# EAGLE schematic 4 (EAGLE 9.2.0)
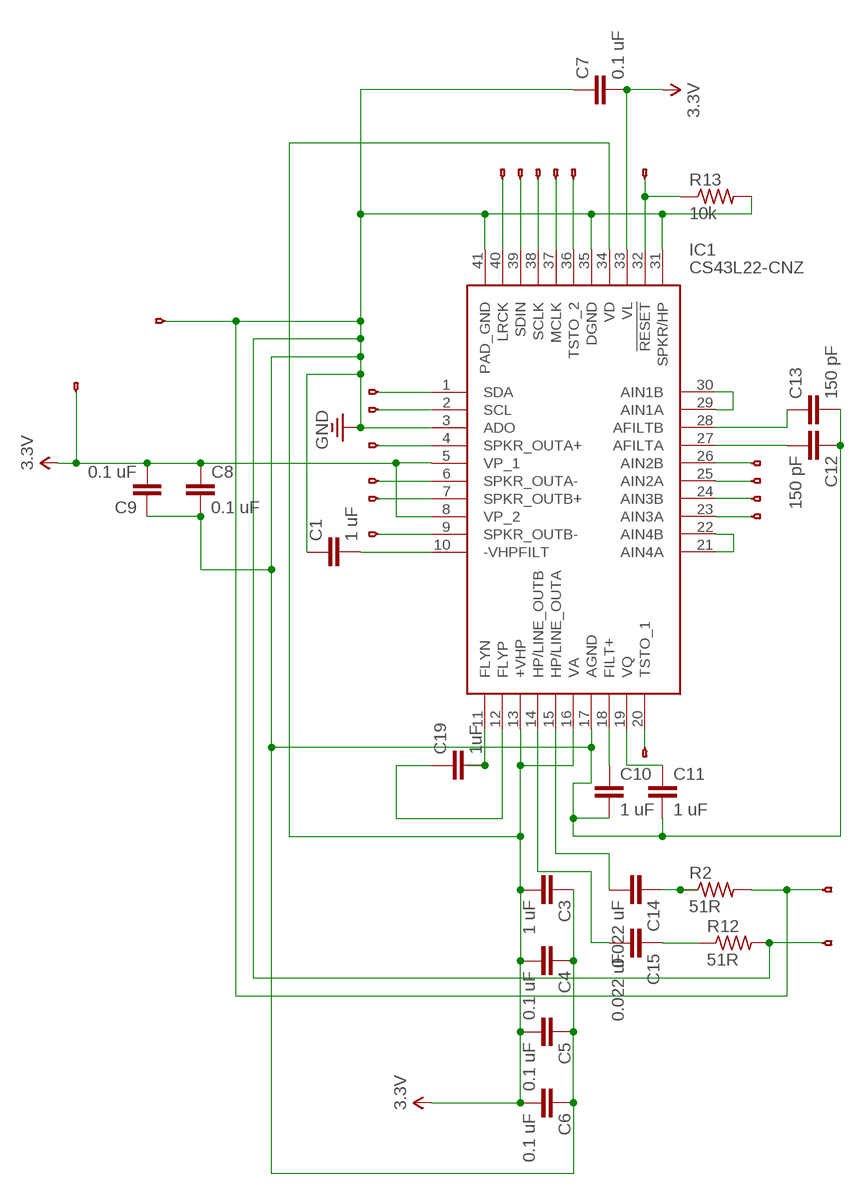
[diagram p0: schematic, sheet 1]

## Parts
C1  1 uF  CAPKIT  [CAP-PTH-SMALL-KIT]
C3  1 uF  CAPKIT  [CAP-PTH-SMALL-KIT]
C4  0.1 uF  CAPKIT  [CAP-PTH-SMALL-KIT]
C5  0.1 uF  CAPKIT  [CAP-PTH-SMALL-KIT]
C6  0.1 uF  CAPKIT  [CAP-PTH-SMALL-KIT]
C7  0.1 uF  CAPKIT  [CAP-PTH-SMALL-KIT]
C8  0.1 uF  CAPKIT  [CAP-PTH-SMALL-KIT]
C9  0.1 uF  CAPKIT  [CAP-PTH-SMALL-KIT]
C10  1 uF  CAPKIT  [CAP-PTH-SMALL-KIT]
C11  1 uF  CAPKIT  [CAP-PTH-SMALL-KIT]
C12  150 pF  CAPKIT  [CAP-PTH-SMALL-KIT]
C13  150 pF  CAPKIT  [CAP-PTH-SMALL-KIT]
C14  0.022 uF  CAPKIT  [CAP-PTH-SMALL-KIT]
C15  0.022 uF  CAPKIT  [CAP-PTH-SMALL-KIT]
C19  1uF  C2,5-3  [C2.5-3]
IC1  CS43L22-CNZ  [QFN50P600X600X100-41N]
JP1  HEADERHOLE-HEADERHOLE  [1X1-HEADER-HOLE]
JP2  HEADERHOLE-HEADERHOLE  [1X1-HEADER-HOLE]
JP3  HEADERHOLE-HEADERHOLE  [1X1-HEADER-HOLE]
JP4  HEADERHOLE-HEADERHOLE  [1X1-HEADER-HOLE]
JP5  HEADERHOLE-HEADERHOLE  [1X1-HEADER-HOLE]
JP6  HEADERHOLE-HEADERHOLE  [1X1-HEADER-HOLE]
JP7  HEADERHOLE-HEADERHOLE  [1X1-HEADER-HOLE]
JP8  HEADERHOLE-HEADERHOLE  [1X1-HEADER-HOLE]
JP9  HEADERHOLE-HEADERHOLE  [1X1-HEADER-HOLE]
JP10  HEADERHOLE-HEADERHOLE  [1X1-HEADER-HOLE]
JP11  HEADERHOLE-HEADERHOLE  [1X1-HEADER-HOLE]
JP12  HEADERHOLE-HEADERHOLE  [1X1-HEADER-HOLE]
JP13  HEADERHOLE-HEADERHOLE  [1X1-HEADER-HOLE]
JP14  HEADERHOLE-HEADERHOLE  [1X1-HEADER-HOLE]
JP15  HEADERHOLE-HEADERHOLE  [1X1-HEADER-HOLE]
JP16  HEADERHOLE-HEADERHOLE  [1X1-HEADER-HOLE]
JP17  HEADERHOLE-HEADERHOLE  [1X1-HEADER-HOLE]
JP18  HEADERHOLE-HEADERHOLE  [1X1-HEADER-HOLE]
JP19  HEADERHOLE-HEADERHOLE  [1X1-HEADER-HOLE]
JP23  HEADERHOLE-HEADERHOLE  [1X1-HEADER-HOLE]
JP24  HEADERHOLE-HEADERHOLE  [1X1-HEADER-HOLE]
R2  51R  R-US_0204/2V  [0204V]
R12  51R  R-US_0204/2V  [0204V]
R13  10k  R-US_0204/2V  [0204V]

## Nets
3.3V: C3.2 C4.2 C5.2 C6.2 C7.2 C8.1 C9.2 IC1.5(VP_1) IC1.8(VP_2) IC1.13(+VHP) IC1.16(VA) IC1.33(VL) IC1.34(VD) JP24.1
GND: C1.1 C3.1 C4.1 C5.1 C6.1 C7.1 C8.2 C9.1 C10.2 C11.2 C12.1 C13.2 IC1.3(ADO) IC1.17(AGND) IC1.31(SPKR/HP) IC1.35(DGND) IC1.41(PAD_GND) JP8.1 JP9.1 JP23.1 R2.2 R12.2 R13.2
N$1: C19.2 IC1.11(FLYN)
N$2: IC1.1(SDA) JP1.1
N$3: IC1.2(SCL) JP2.1
N$4: IC1.37(MCLK) JP3.1
N$5: IC1.38(SCLK) JP4.1
N$6: IC1.39(SDIN) JP5.1
N$7: IC1.40(LRCK) JP6.1
N$8: IC1.32(!RESET) JP7.1 R13.1
N$9: C1.2 IC1.10(-VHPFILT)
N$10: C19.1 IC1.12(FLYP)
N$11: C11.1 IC1.19(VQ)
N$13: C12.2 IC1.27(AFILTA)
N$14: C13.1 IC1.28(AFILTB)
N$15: C14.2 IC1.15(HP/LINE_OUTA)
N$16: C10.1 IC1.18(FILT+)
N$17: C15.2 IC1.14(HP/LINE_OUTB)
N$18: C14.1 R2.1
N$19: C15.1 R12.1
N$21: IC1.4(SPKR_OUTA+) JP10.1
N$22: IC1.6(SPKR_OUTA-) JP11.1
N$23: IC1.7(SPKR_OUTB+) JP12.1
N$24: IC1.9(SPKR_OUTB-) JP13.1
N$25: IC1.26(AIN2B) JP17.1
N$26: IC1.25(AIN2A) JP16.1
N$27: IC1.24(AIN3B) JP15.1
N$28: IC1.23(AIN3A) JP14.1
N$29: IC1.36(TSTO_2) JP19.1
N$30: IC1.20(TSTO_1) JP18.1
N$31: IC1.29(AIN1A) IC1.30(AIN1B)
N$32: IC1.21(AIN4A) IC1.22(AIN4B)

## Library data of the parts
C1 C3-C15 = F405Pill:CAP: Capacitor Standard 0603 ceramic capacitor, and 0.1" leaded capacitor.
C19 = capacitor-wima:C: CAPACITOR naming: grid - package width
IC1 = CS43L22-CNZ:CS43L22-CNZ: CS43L22-CNZ, Audio DAC 24 bit-, 96ksps Serial, 40-Pin QFN Source: Datasheet <https://d3uzseaevmutz1.cloudfront.net/pubs/proDatasheet/CS43L22_F2.pdf>; DESCRIPTION: CS43L22-CNZ, Audio DAC 24 bit-, 96ksps Serial, 40-Pin QFN; HEIGHT: 1mm; MANUFACTURER_NAME: Cirrus Logic; MANUFACTURER_PART_NUMBER: CS43L22-CNZ; MOUSER_PART_NUMBER: 777-CS43L22-CNZ; MOUSER_PRICE-STOCK: https://www.mouser.com/Search/Refine.aspx?Keyword=777-CS43L22-CNZ; RS_PART_NUMBER: 7165851P; RS_PRICE-STOCK: http://uk.rs-online.com/web/p/products/7165851P
JP1-JP19 JP23 JP24 = F405Pill:HEADERHOLE
R2 R12 R13 = rcl:R-US_: RESISTOR, American symbol; SPICEPREFIX: R